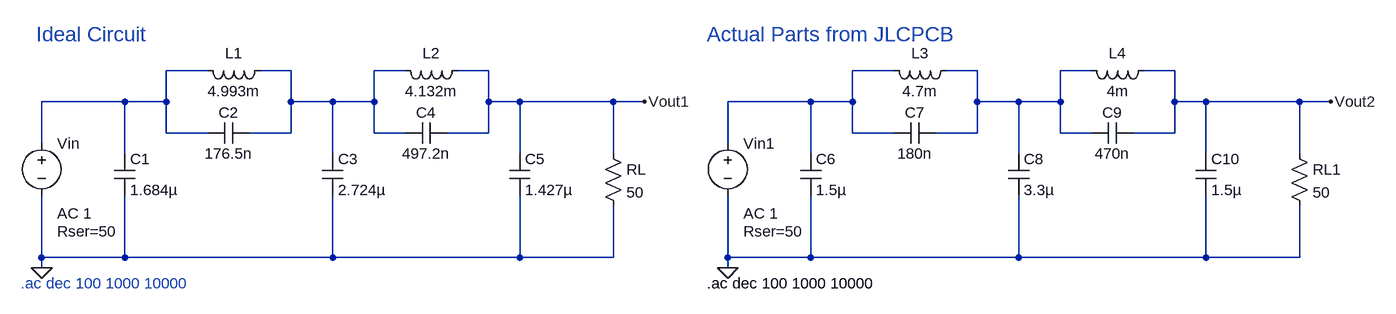
[diagram p0: schematic LPFilter_2kHz_Elliptical.asc]
LPFilter_2kHz_Elliptical.asc, the LTspice schematic file:
Version 4.1
SHEET 1 2084 728
WIRE 272 -128 208 -128
WIRE 400 -128 352 -128
WIRE 576 -128 528 -128
WIRE 704 -128 656 -128
WIRE 1328 -128 1264 -128
WIRE 1456 -128 1408 -128
WIRE 1632 -128 1584 -128
WIRE 1760 -128 1712 -128
WIRE 144 -80 16 -80
WIRE 208 -80 208 -128
WIRE 208 -80 144 -80
WIRE 400 -80 400 -128
WIRE 464 -80 400 -80
WIRE 528 -80 528 -128
WIRE 528 -80 464 -80
WIRE 704 -80 704 -128
WIRE 752 -80 704 -80
WIRE 896 -80 752 -80
WIRE 944 -80 896 -80
WIRE 1200 -80 1072 -80
WIRE 1264 -80 1264 -128
WIRE 1264 -80 1200 -80
WIRE 1456 -80 1456 -128
WIRE 1520 -80 1456 -80
WIRE 1584 -80 1584 -128
WIRE 1584 -80 1520 -80
WIRE 1760 -80 1760 -128
WIRE 1808 -80 1760 -80
WIRE 1952 -80 1808 -80
WIRE 2000 -80 1952 -80
WIRE 208 -32 208 -80
WIRE 272 -32 208 -32
WIRE 400 -32 400 -80
WIRE 400 -32 336 -32
WIRE 528 -32 528 -80
WIRE 576 -32 528 -32
WIRE 704 -32 704 -80
WIRE 704 -32 640 -32
WIRE 1264 -32 1264 -80
WIRE 1328 -32 1264 -32
WIRE 1456 -32 1456 -80
WIRE 1456 -32 1392 -32
WIRE 1584 -32 1584 -80
WIRE 1632 -32 1584 -32
WIRE 1760 -32 1760 -80
WIRE 1760 -32 1696 -32
WIRE 16 -16 16 -80
WIRE 1072 -16 1072 -80
WIRE 144 0 144 -80
WIRE 464 0 464 -80
WIRE 752 0 752 -80
WIRE 896 0 896 -80
WIRE 1200 0 1200 -80
WIRE 1520 0 1520 -80
WIRE 1808 0 1808 -80
WIRE 1952 0 1952 -80
WIRE 16 160 16 64
WIRE 144 160 144 64
WIRE 144 160 16 160
WIRE 464 160 464 64
WIRE 464 160 144 160
WIRE 752 160 752 64
WIRE 752 160 464 160
WIRE 896 160 896 80
WIRE 896 160 752 160
WIRE 1072 160 1072 64
WIRE 1200 160 1200 64
WIRE 1200 160 1072 160
WIRE 1520 160 1520 64
WIRE 1520 160 1200 160
WIRE 1808 160 1808 64
WIRE 1808 160 1520 160
WIRE 1952 160 1952 80
WIRE 1952 160 1808 160
WIRE 16 176 16 160
WIRE 1072 176 1072 160
FLAG 16 176 0
FLAG 1072 176 0
FLAG 944 -80 Vout1
FLAG 2000 -80 Vout2
SYMBOL voltage 16 -32 R0
WINDOW 123 24 124 Left 2
WINDOW 39 24 152 Left 2
SYMATTR Value2 AC 1
SYMATTR SpiceLine Rser=50
SYMATTR InstName Vin
SYMATTR Value ""
SYMBOL cap 128 0 R0
SYMATTR InstName C1
SYMATTR Value 1.684µ
SYMBOL cap 336 -48 R90
WINDOW 0 0 32 VBottom 2
WINDOW 3 32 32 VTop 2
SYMATTR InstName C2
SYMATTR Value 176.5n
SYMBOL ind 368 -144 R90
WINDOW 0 5 56 VBottom 2
WINDOW 3 32 56 VTop 2
SYMATTR InstName L1
SYMATTR Value 4.993m
SYMBOL cap 448 0 R0
SYMATTR InstName C3
SYMATTR Value 2.724µ
SYMBOL cap 640 -48 R90
WINDOW 0 0 32 VBottom 2
WINDOW 3 32 32 VTop 2
SYMATTR InstName C4
SYMATTR Value 497.2n
SYMBOL ind 672 -144 R90
WINDOW 0 5 56 VBottom 2
WINDOW 3 32 56 VTop 2
SYMATTR InstName L2
SYMATTR Value 4.132m
SYMBOL cap 736 0 R0
SYMATTR InstName C5
SYMATTR Value 1.427µ
SYMBOL res 880 -16 R0
SYMATTR InstName RL
SYMATTR Value 50
SYMBOL voltage 1072 -32 R0
WINDOW 123 24 124 Left 2
WINDOW 39 24 152 Left 2
SYMATTR Value2 AC 1
SYMATTR SpiceLine Rser=50
SYMATTR InstName Vin1
SYMATTR Value ""
SYMBOL cap 1184 0 R0
SYMATTR InstName C6
SYMATTR Value 1.5µ
SYMBOL cap 1392 -48 R90
WINDOW 0 0 32 VBottom 2
WINDOW 3 32 32 VTop 2
SYMATTR InstName C7
SYMATTR Value 180n
SYMBOL ind 1424 -144 R90
WINDOW 0 5 56 VBottom 2
WINDOW 3 32 56 VTop 2
SYMATTR InstName L3
SYMATTR Value 4.7m
SYMATTR SpiceLine Rser=12.5
SYMBOL cap 1504 0 R0
SYMATTR InstName C8
SYMATTR Value 3.3µ
SYMBOL cap 1696 -48 R90
WINDOW 0 0 32 VBottom 2
WINDOW 3 32 32 VTop 2
SYMATTR InstName C9
SYMATTR Value 470n
SYMBOL ind 1728 -144 R90
WINDOW 0 5 56 VBottom 2
WINDOW 3 32 56 VTop 2
SYMATTR InstName L4
SYMATTR Value 4m
SYMATTR SpiceLine Rser=12.35
SYMBOL cap 1792 0 R0
SYMATTR InstName C10
SYMATTR Value 1.5µ
SYMBOL res 1936 -16 R0
SYMATTR InstName RL1
SYMATTR Value 50
TEXT -16 200 Left 2 ;.ac dec 100 1000 10000
TEXT 1040 200 Left 2 !.ac dec 100 1000 10000
TEXT 8 -184 Left 3 ;Ideal Circuit
TEXT 1040 -184 Left 3 ;Actual Parts from JLCPCB

The netlist it stands for:
* LPFilter_2kHz_Elliptical.asc
Vin N001 0 AC 1 Rser=50
C1 N001 0 1.684µ
C2 N002 N001 176.5n
L1 N002 N001 4.993m
C3 N002 0 2.724µ
C4 Vout1 N002 497.2n
L2 Vout1 N002 4.132m
C5 Vout1 0 1.427µ
RL Vout1 0 50
Vin1 N003 0 AC 1 Rser=50
C6 N003 0 1.5µ
C7 N004 N003 180n
L3 N004 N003 4.7m Rser=12.5
C8 N004 0 3.3µ
C9 Vout2 N004 470n
L4 Vout2 N004 4m Rser=12.35
C10 Vout2 0 1.5µ
RL1 Vout2 0 50
* .ac dec 100 1000 10000
.ac dec 100 1000 10000
* Ideal Circuit
* Actual Parts from JLCPCB
.backanno
.end

* Results of the author's LTspice run, read from the files saved beside the schematic
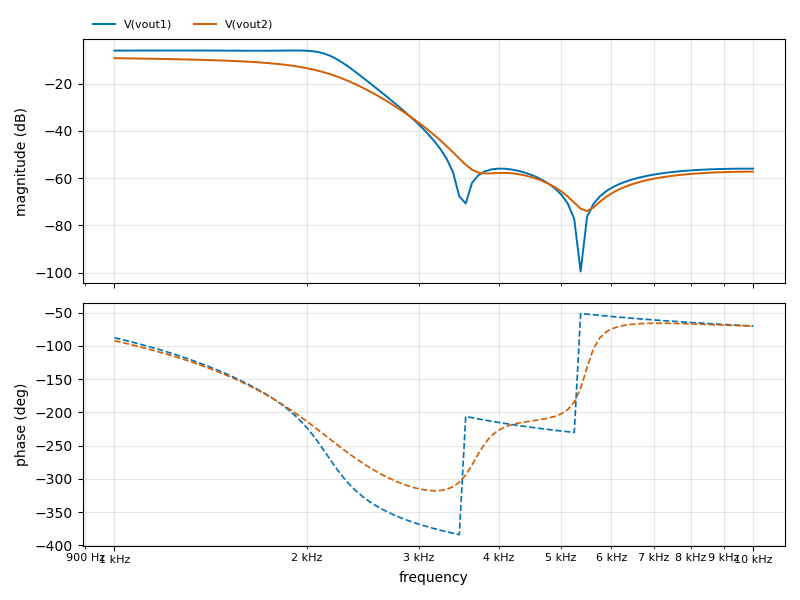
[diagram p1: AC Analysis of LPFilter_2kHz_Elliptical.asc, plotted from the saved traces]
* AC Analysis, 1 run:
*   V(vout1): -6.07 dB at 1 kHz, -56.02 dB at 10 kHz, peak -6.02 dB at 1.259 kHz, 3 dB below the peak at 2.205 kHz
*   V(vout2): -9.25 dB at 1 kHz, -57.30 dB at 10 kHz, peak -9.25 dB at 1 kHz, 3 dB below the peak at 1.874 kHz